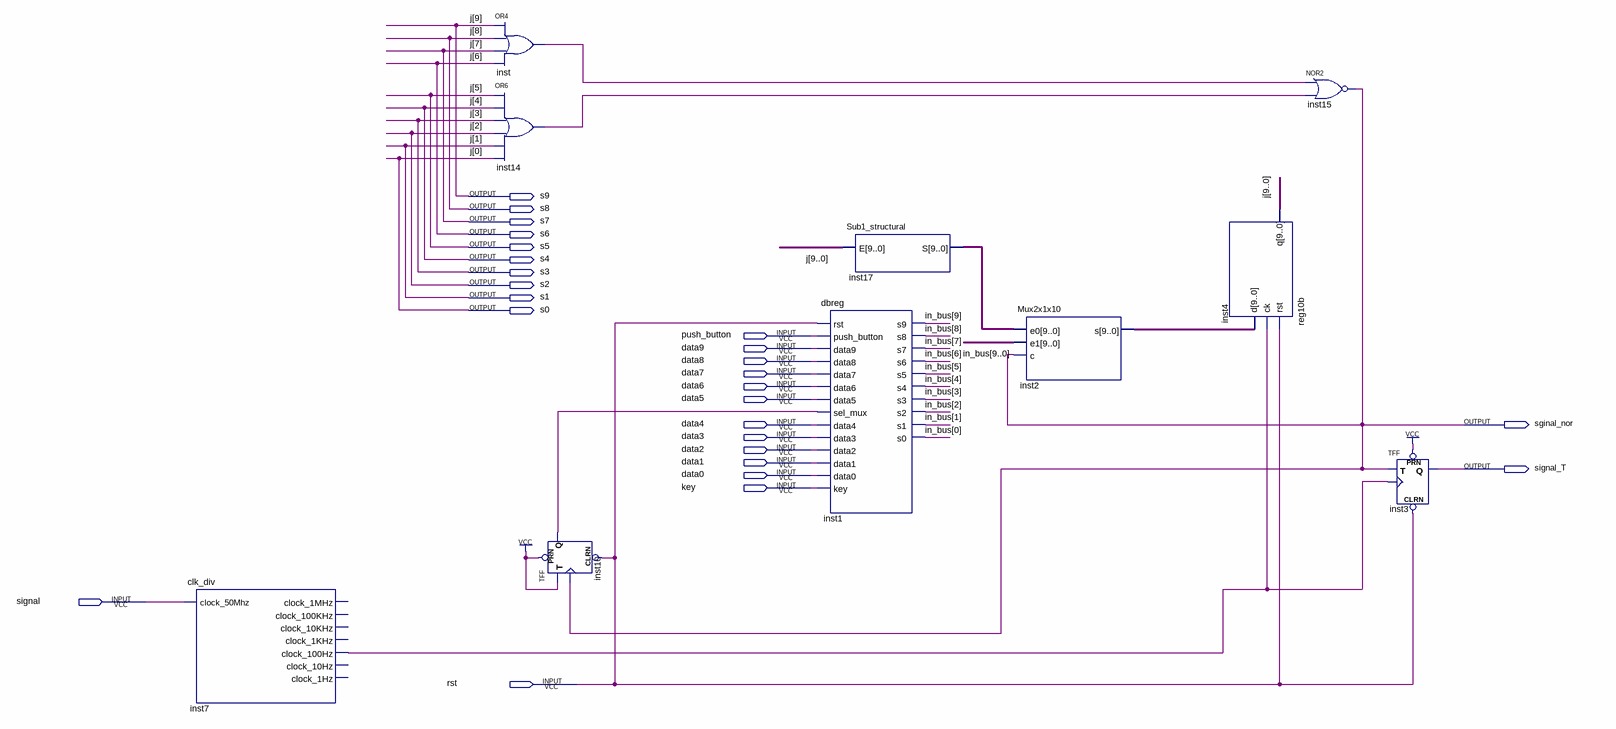
[diagram p0: schematic sheet]
// Quartus schematic exercicio01.bdf as structural Verilog: 10 symbols, 26 pins
module exercicio01 (
  input  push_button,
  input  data9,
  input  data8,
  input  data7,
  input  data6,
  input  data5,
  input  data4,
  input  data3,
  input  data2,
  input  data1,
  input  data0,
  input  key,
  input  signal,
  input  rst,
  output s9,
  output s8,
  output s7,
  output s6,
  output s5,
  output s4,
  output s3,
  output s2,
  output s1,
  output s0,
  output sginal_nor,
  output signal_T
);

  wire inst7_clock_100hz, inst10_q, inst14_out, inst_out;
  wire [9:0] in_bus, inst2_s, inst17_s;

  clk_div inst7 (
    .clock_50Mhz(signal), .clock_100Hz(inst7_clock_100hz));  // open: clock_1MHz, clock_100KHz, clock_10KHz, clock_1KHz, clock_10Hz, clock_1Hz
  or inst (inst_out, s9, s8, s7, s6);
  or inst14 (inst14_out, s5, s4, s3, s2, s1, s0);
  TFF inst10 (.PRN(1'b1), .CLRN(rst), .T(1'b1), .CLK(sginal_nor), .Q(inst10_q));
  Sub1_structural inst17 (.E({s9, s8, s7, s6, s5, s4, s3, s2, s1, s0}), .S(inst17_s));
  dbreg inst1 (
    .rst(rst), .push_button(push_button), .data9(data9), .data8(data8), .data7(data7), .data6(data6),
    .data5(data5), .sel_mux(inst10_q), .data4(data4), .data3(data3), .data2(data2), .data1(data1),
    .data0(data0), .key(key), .s9(in_bus[9]), .s8(in_bus[8]), .s7(in_bus[7]), .s6(in_bus[6]), .s5(in_bus[5]),
    .s4(in_bus[4]), .s3(in_bus[3]), .s2(in_bus[2]), .s1(in_bus[1]), .s0(in_bus[0]));
  Mux2x1x10 inst2 (.e0(inst17_s), .e1(in_bus), .c(sginal_nor), .s(inst2_s));
  reg10b inst4 (.rst(rst), .ck(inst7_clock_100hz), .d(inst2_s), .q({s9, s8, s7, s6, s5, s4, s3, s2, s1, s0}));
  nor inst15 (sginal_nor, inst_out, inst14_out);
  TFF inst3 (.PRN(1'b1), .CLRN(rst), .T(sginal_nor), .CLK(inst7_clock_100hz), .Q(signal_T));

  // Other names for the same wires on the sheet: j[9:0] = {s9, s8, s7, s6, s5, s4, s3, s2, s1, s0}
endmodule
